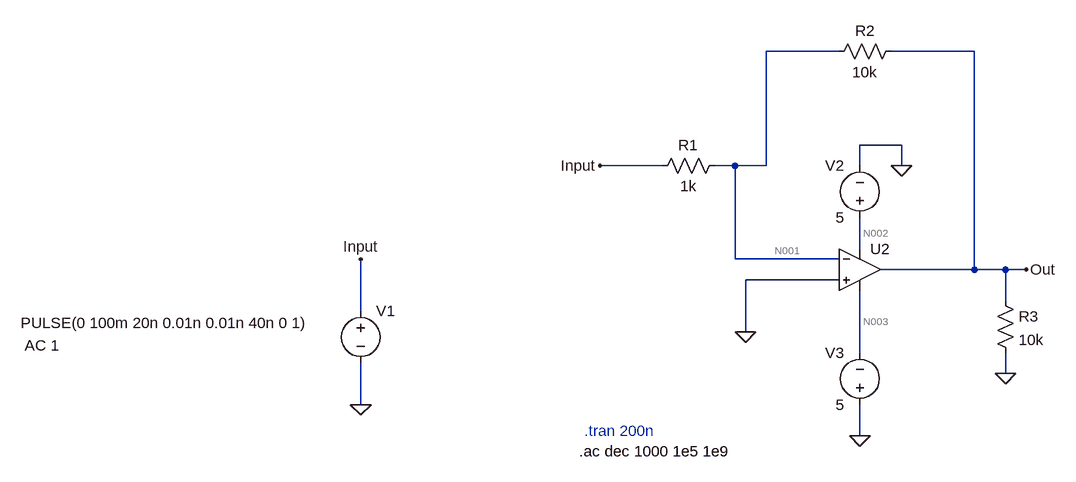
[diagram p0: schematic preamp_v5_ajustadocondata.asc]
preamp_v5_ajustadocondata.asc, the LTspice schematic file:
Version 4
SHEET 1 880 680
WIRE 272 -112 160 -112
WIRE 480 -112 352 -112
WIRE 368 32 304 32
WIRE 0 64 -96 64
WIRE 112 64 80 64
WIRE 160 64 160 -112
WIRE 160 64 112 64
WIRE 304 64 304 32
WIRE 368 64 368 32
WIRE 304 192 304 144
WIRE 112 208 112 64
WIRE 272 208 112 208
WIRE 480 224 480 -112
WIRE 480 224 336 224
WIRE 528 224 480 224
WIRE 560 224 528 224
WIRE 272 240 128 240
WIRE 528 272 528 224
WIRE -464 288 -464 208
WIRE 128 320 128 240
WIRE 304 352 304 256
WIRE 528 384 528 352
WIRE -464 432 -464 368
WIRE 304 480 304 432
FLAG 304 480 0
FLAG 368 64 0
FLAG -464 432 0
FLAG 560 224 Out
FLAG 528 384 0
FLAG 128 320 0
FLAG -464 208 Input
FLAG -96 64 Input
SYMBOL voltage -464 272 R0
WINDOW 123 -517 69 Left 2
WINDOW 39 0 0 Left 0
WINDOW 3 -523 34 Left 2
SYMATTR Value2 AC 1
SYMATTR Value PULSE(0 100m 20n 0.01n 0.01n 40n 0 1)
SYMATTR InstName V1
SYMBOL res 96 48 R90
WINDOW 0 0 56 VBottom 2
WINDOW 3 32 56 VTop 2
SYMATTR InstName R1
SYMATTR Value 1k
SYMBOL res 368 -128 R90
WINDOW 0 0 56 VBottom 2
WINDOW 3 32 56 VTop 2
SYMATTR InstName R2
SYMATTR Value 10k
SYMBOL voltage 304 160 R180
WINDOW 0 24 96 Left 2
WINDOW 3 24 16 Left 2
WINDOW 123 0 0 Left 0
WINDOW 39 0 0 Left 0
SYMATTR InstName V2
SYMATTR Value 5
SYMBOL voltage 304 448 R180
WINDOW 0 24 96 Left 2
WINDOW 3 24 16 Left 2
WINDOW 123 0 0 Left 0
WINDOW 39 0 0 Left 0
SYMATTR InstName V3
SYMATTR Value 5
SYMBOL OpAmps\\UniversalOpAmp1 304 224 R0
SYMATTR InstName U2
SYMATTR Value2 Avol=1Meg GBW=100Meg Vos=0
SYMBOL res 512 256 R0
SYMATTR InstName R3
SYMATTR Value 10k
TEXT -128 504 Left 2 !.ac dec 1000 1e5 1e9
TEXT -120 472 Left 2 ;.tran 200n

The netlist it stands for:
* preamp_v5_ajustadocondata.asc
V1 Input 0 PULSE(0 100m 20n 0.01n 0.01n 40n 0 1) AC 1
R1 N001 Input 1k
R2 Out N001 10k
V2 N002 0 5
V3 0 N003 5
XU2 0 N001 N002 N003 Out level1 Avol=1Meg GBW=100Meg Vos=0 En=0 Enk=0 In=0 Ink=0 Rin=500Meg  ; pins In+ In- V+ V- OUT
R3 Out 0 10k
.ac dec 1000 1e5 1e9
* .tran 200n
.lib UniversalOpAmp1.lib
.backanno
.end

* Results of the author's LTspice run, read from the files saved beside the schematic
* Operating Point, zero values left out:
*   V(n002) = 5 V
*   V(n003) = -5 V
*   I(V2) = -10 nA
*   I(V3) = -10 nA
*   Ix(u2:3) = 10 nA
*   Ix(u2:4) = -10 nA
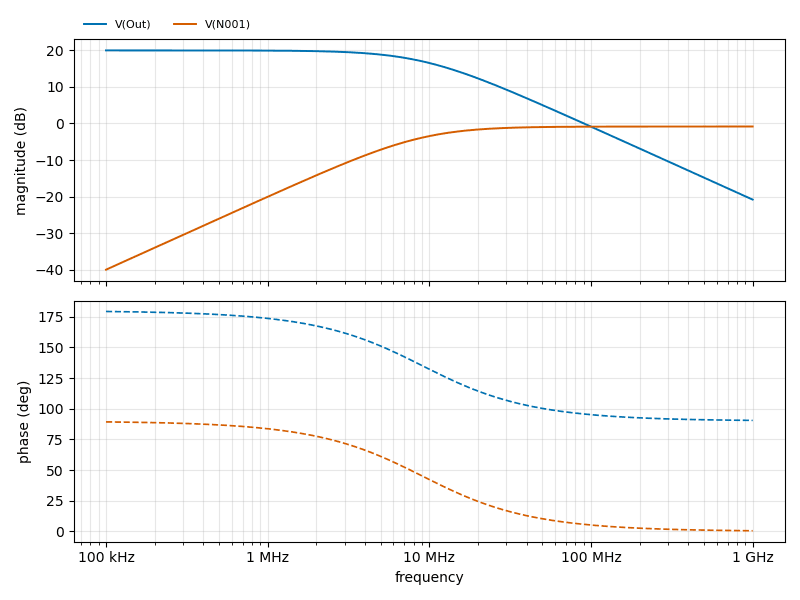
[diagram p1: AC Analysis of preamp_v5_ajustadocondata.asc, plotted from the saved traces]
* AC Analysis, 1 run:
*   V(Out): 20.00 dB at 100 kHz, -20.83 dB at 1 GHz, peak 20.00 dB at 100 kHz, 3 dB below the peak at 9.092 MHz
*   V(N001): -40.00 dB at 100 kHz, -0.83 dB at 1 GHz, peak -0.83 dB at 1 GHz, 3 dB below the peak at 9.09 MHz